# Altium schematic sheet MCU_144_2.SchDoc: MCU
size A3; DocumentNumber: MB1137; Revision: B-01; SheetNumber: 2; SheetTotal: 6; Project: NUCLEO-XXXXZX
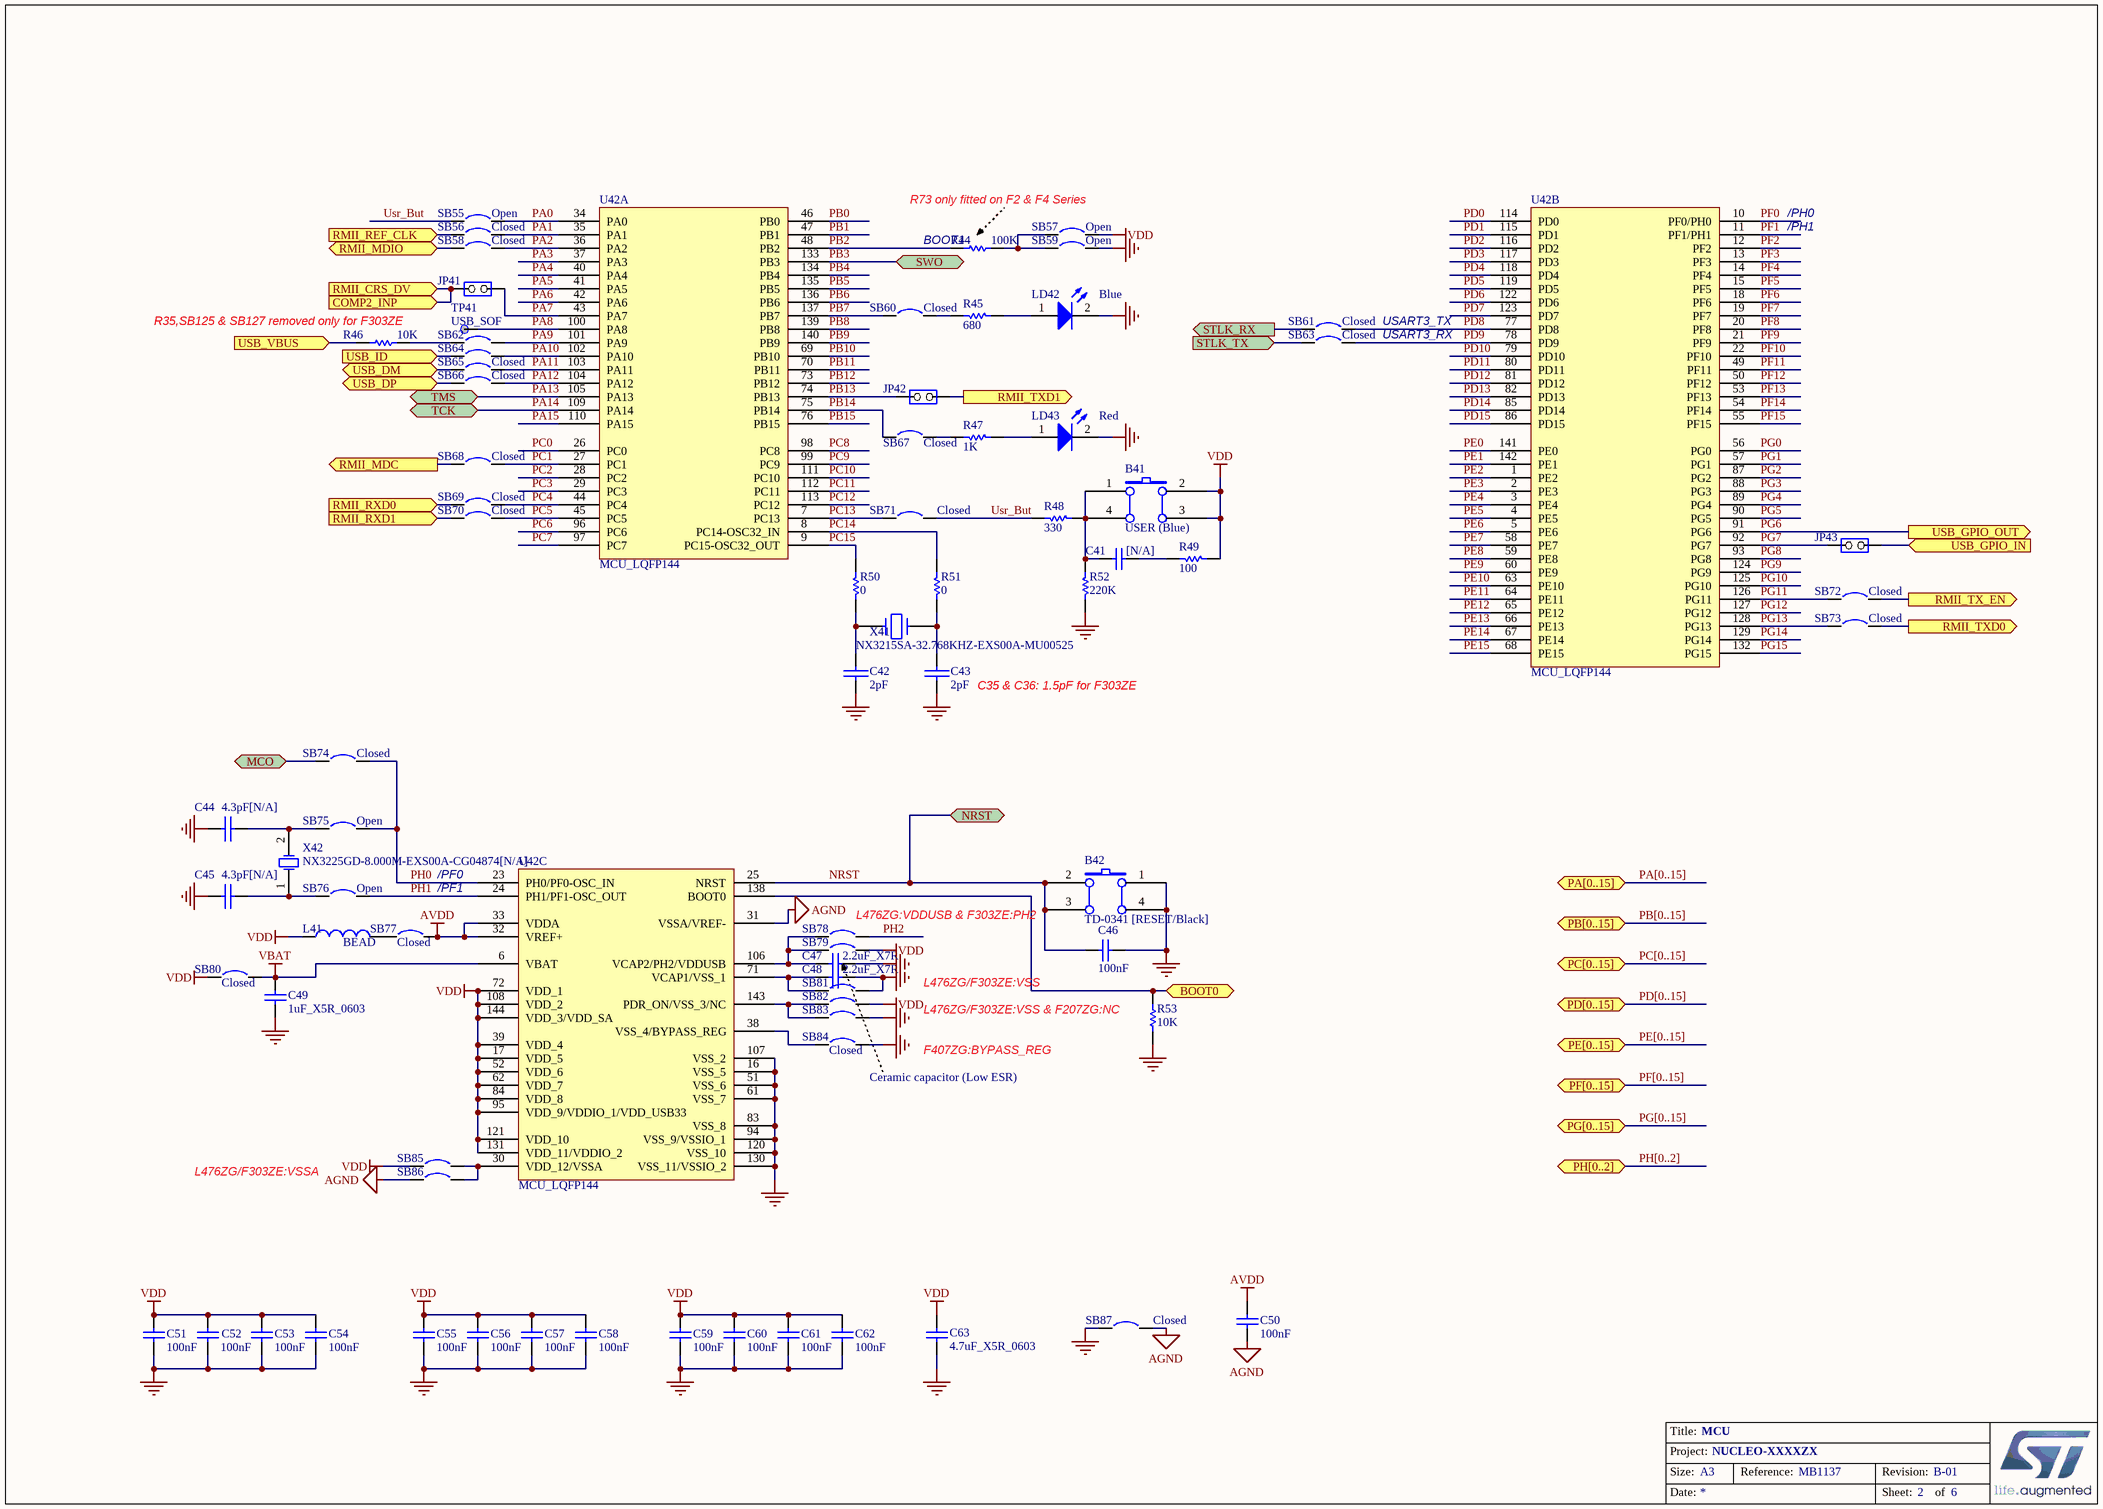
[diagram p0: MCU_144_2.SchDoc]

## Parts
B41  USER (Blue)  [PB-6X6mm-Blue]
B42  TD-0341 [RESET/Black]  [PB-6X6mm-Black]
C41  [N/A]  [0603C]
C42  2pF  [0603C]
C43  2pF  [0603C]
C44  4.3pF[N/A]  [0603C]
C45  4.3pF[N/A]  [0603C]
C46  100nF  [0603C]
C47  2.2uF_X7R  [TAN-A]
C48  2.2uF_X7R  [TAN-A]
C49  1uF_X5R_0603  [0603C]
C50  100nF  [0603C]
C51  100nF  [0603C]
C52  100nF  [0603C]
C53  100nF  [0603C]
C54  100nF  [0603C]
C55  100nF  [0603C]
C56  100nF  [0603C]
C57  100nF  [0603C]
C58  100nF  [0603C]
C59  100nF  [0603C]
C60  100nF  [0603C]
C61  100nF  [0603C]
C62  100nF  [0603C]
C63  4.7uF_X5R_0603  [0603C]
JP41  (no value)  [HDR_1x2_2R54_V_M_S]
JP42  (no value)  [HDR_1x2_2R54_V_M_S]
JP43  (no value)  [HDR_1x2_2R54_V_M_S]
L41  BEAD  [0603L]
LD42  Blue  [0603D-B]
LD43  Red  [0603D-R]
R44  100K  [0603R]
R45  680  [0603R]
R46  10K  [0603R]
R47  1K  [0603R]
R48  330  [0603R]
R49  100  [0603R]
R50  0  [0603R]
R51  0  [0603R]
R52  220K  [0603R]
R53  10K  [0603R]
SB55  Open  [SB_0603]
SB56  Closed  [SB_0603]
SB57  Open  [SB_0603]
SB58  Closed  [SB_0603]
SB59  Open  [SB_0603]
SB60  Closed  [SB_0603]
SB61  Closed  [SB_0603]
SB62  Circuit Breaker  [SB_0603]  (value not drawn)
SB63  Closed  [SB_0603]
SB64  Circuit Breaker  [SB_0603]  (value not drawn)
SB65  Closed  [SB_0603]
SB66  Closed  [SB_0603]
SB67  Closed  [SB_0603]
SB68  Closed  [SB_0603]
SB69  Closed  [SB_0603]
SB70  Closed  [SB_0603]
SB71  Closed  [SB_0603]
SB72  Closed  [SB_0603]
SB73  Closed  [SB_0603]
SB74  Closed  [SB_0603]
SB75  Open  [SB_0603]
SB76  Open  [SB_0603]
SB77  Closed  [SB_0603]
SB78  Circuit Breaker  [SB_0603]  (value not drawn)
SB79  Circuit Breaker  [SB_0603]  (value not drawn)
SB80  Closed  [SB_0603]
SB81  Circuit Breaker  [SB_0603]  (value not drawn)
SB82  Circuit Breaker  [SB_0603]  (value not drawn)
SB83  Circuit Breaker  [SB_0603]  (value not drawn)
SB84  Closed  [SB_0603]
SB85  Circuit Breaker  [SB_0603]  (value not drawn)
SB86  Circuit Breaker  [SB_0603]  (value not drawn)
SB87  Closed  [SB_0603]
TP41  USB_SOF  [TP]
U42  MCU_LQFP144  [LQFP144_0R5_SKT]  (parts A,B,C of 3)
X41  NX3215SA-32.768KHZ-EXS00A-MU00525  [XTAL_2SM_3R2X1R5]
X42  NX3225GD-8.000M-EXS00A-CG04874[N/A]  [OSC_2SM_3R2x2R5]

## Ports
BOOT0, COMP2_INP (in), MCO, NRST, PA[0..15] (bidir), PB[0..15] (bidir), PC[0..15] (bidir), PD[0..15] (bidir), PE[0..15] (bidir), PF[0..15] (bidir), PG[0..15] (bidir), PH[0..2] (bidir), RMII_CRS_DV (in), RMII_MDC (out), RMII_MDIO (bidir), RMII_REF_CLK (in), RMII_RXD0 (in), RMII_RXD1 (in), RMII_TX_EN (out), RMII_TXD0 (out), RMII_TXD1 (out), STLK_RX (out), STLK_TX (in), SWO, TCK, TMS, USB_DM (bidir), USB_DP (bidir), USB_GPIO_IN (in), USB_GPIO_OUT (out), USB_ID (in), USB_VBUS (in)

## Nets
AGND: C50.2 SB86.1 SB87.2 U42.31(VSSA/VREF-)
AVDD: C50.1 SB77.2 U42.32(VREF+) U42.33(VDDA)
GND: B42.1(A0) B42.4(A1) C42.2 C43.2 C44.2 C45.2 C46.1 C47.2 C48.2 C49.2 C51.2 C52.2 C53.2 C54.2 C55.2 C56.2 C57.2 C58.2 C59.2 C60.2 C61.2 C62.2 C63.2 LD42.2(K) LD43.2(K) R52.2 R53.2 SB59.2 SB81.2 SB83.2 SB84.2 SB87.1 U42.16(VSS_5) U42.51(VSS_6) U42.61(VSS_7) U42.83(VSS_8) U42.94(VSS_9/VSSIO_1) U42.107(VSS_2) U42.120(VSS_10) U42.130(VSS_11/VSSIO_2)
VBAT: C49.1 SB80.2 U42.6(VBAT)
VDD: B41.2(B0) B41.3(B1) C51.1 C52.1 C53.1 C54.1 C55.1 C56.1 C57.1 C58.1 C59.1 C60.1 C61.1 C62.1 C63.1 L41.1 R49.1 SB57.2 SB79.2 SB80.1 SB82.2 SB85.1 U42.17(VDD_5) U42.39(VDD_4) U42.52(VDD_6) U42.62(VDD_7) U42.72(VDD_1) U42.84(VDD_8) U42.95(VDD_9/VDDIO_1/VDD_USB33) U42.108(VDD_2) U42.121(VDD_10) U42.131(VDD_11/VDDIO_2) U42.144(VDD_3/VDD_SA)
BOOT0: R53.1 U42.138(BOOT0) ; port BOOT0
COMP2_INP: JP41.2(NO) ; port RMII_CRS_DV, port COMP2_INP
MCO: SB74.1 ; port MCO
NRST: B42.2(B0) B42.3(B1) C46.2 U42.25(NRST) ; port NRST
PA0: SB55.2 U42.34(PA0)
PA1: SB56.2 U42.35(PA1)
PA2: SB58.2 U42.36(PA2)
PA3: U42.37(PA3)
PA4: U42.40(PA4)
PA5: U42.41(PA5)
PA6: U42.42(PA6)
PA7: JP41.1(COMMON) U42.43(PA7)
PA8: TP41.1 U42.100(PA8)
PA9: SB62.2 U42.101(PA9)
PA10: SB64.2 U42.102(PA10)
PA11: SB65.2 U42.103(PA11)
PA12: SB66.2 U42.104(PA12)
PA13: U42.105(PA13) ; port TMS
PA14: U42.109(PA14) ; port TCK
PA15: U42.110(PA15)
PB0: U42.46(PB0)
PB1: U42.47(PB1)
PB2: R44.1 U42.48(PB2)
PB3: U42.133(PB3) ; port SWO
PB4: U42.134(PB4)
PB5: U42.135(PB5)
PB6: U42.136(PB6)
PB7: SB60.1 U42.137(PB7)
PB8: U42.139(PB8)
PB9: U42.140(PB9)
PB10: U42.69(PB10)
PB11: U42.70(PB11)
PB12: U42.73(PB12)
PB13: JP42.2(NO) U42.74(PB13)
PB14: SB67.1 U42.75(PB14)
PB15: U42.76(PB15)
PC0: U42.26(PC0)
PC1: SB68.2 U42.27(PC1)
PC2: U42.28(PC2)
PC3: U42.29(PC3)
PC4: SB69.2 U42.44(PC4)
PC5: SB70.2 U42.45(PC5)
PC6: U42.96(PC6)
PC7: U42.97(PC7)
PC8: U42.98(PC8)
PC9: U42.99(PC9)
PC10: U42.111(PC10)
PC11: U42.112(PC11)
PC12: U42.113(PC12)
PC13: SB71.1 U42.7(PC13)
PC14: R51.2 U42.8(PC14-OSC32_IN)
PC15: R50.2 U42.9(PC15-OSC32_OUT)
PD0: U42.114(PD0)
PD1: U42.115(PD1)
PD2: U42.116(PD2)
PD3: U42.117(PD3)
PD4: U42.118(PD4)
PD5: U42.119(PD5)
PD6: U42.122(PD6)
PD7: U42.123(PD7)
PD8: SB61.2 U42.77(PD8)
PD9: SB63.2 U42.78(PD9)
PD10: U42.79(PD10)
PD11: U42.80(PD11)
PD12: U42.81(PD12)
PD13: U42.82(PD13)
PD14: U42.85(PD14)
PD15: U42.86(PD15)
PE0: U42.141(PE0)
PE1: U42.142(PE1)
PE2: U42.1(PE2)
PE3: U42.2(PE3)
PE4: U42.3(PE4)
PE5: U42.4(PE5)
PE6: U42.5(PE6)
PE7: U42.58(PE7)
PE8: U42.59(PE8)
PE9: U42.60(PE9)
PE10: U42.63(PE10)
PE11: U42.64(PE11)
PE12: U42.65(PE12)
PE13: U42.66(PE13)
PE14: U42.67(PE14)
PE15: U42.68(PE15)
PF0: U42.10(PF0/PH0)
PF1: U42.11(PF1/PH1)
PF2: U42.12(PF2)
PF3: U42.13(PF3)
PF4: U42.14(PF4)
PF5: U42.15(PF5)
PF6: U42.18(PF6)
PF7: U42.19(PF7)
PF8: U42.20(PF8)
PF9: U42.21(PF9)
PF10: U42.22(PF10)
PF11: U42.49(PF11)
PF12: U42.50(PF12)
PF13: U42.53(PF13)
PF14: U42.54(PF14)
PF15: U42.55(PF15)
PG0: U42.56(PG0)
PG1: U42.57(PG1)
PG2: U42.87(PG2)
PG3: U42.88(PG3)
PG4: U42.89(PG4)
PG5: U42.90(PG5)
PG6: U42.91(PG6) ; port USB_GPIO_OUT
PG7: JP43.2(NO) U42.92(PG7)
PG8: U42.93(PG8)
PG9: U42.124(PG9)
PG10: U42.125(PG10)
PG11: SB72.1 U42.126(PG11)
PG12: U42.127(PG12)
PG13: SB73.1 U42.128(PG13)
PG14: U42.129(PG14)
PG15: U42.132(PG15)
PH0: SB74.2 SB75.2 U42.23(PH0/PF0-OSC_IN)
PH1: SB76.2 U42.24(PH1/PF1-OSC_OUT)
PH2: SB78.2
RMII_MDC: SB68.1 ; port RMII_MDC
RMII_MDIO: SB58.1 ; port RMII_MDIO
RMII_REF_CLK: SB56.1 ; port RMII_REF_CLK
RMII_RXD0: SB69.1 ; port RMII_RXD0
RMII_RXD1: SB70.1 ; port RMII_RXD1
RMII_TX_EN: SB72.2 ; port RMII_TX_EN
RMII_TXD0: SB73.2 ; port RMII_TXD0
RMII_TXD1: JP42.1(COMMON) ; port RMII_TXD1
STLK_RX: SB61.1 ; port STLK_RX
STLK_TX: SB63.1 ; port STLK_TX
USB_DM: SB65.1 ; port USB_DM
USB_DP: SB66.1 ; port USB_DP
USB_GPIO_IN: JP43.1(COMMON) ; port USB_GPIO_IN
USB_ID: SB64.1 ; port USB_ID
USB_VBUS: R46.1 ; port USB_VBUS
Usr_But: R48.2 SB55.1 SB71.2
NetB41_1: B41.1(A0) B41.4(A1) C41.2 R48.1 R52.1
NetC41_1: C41.1 R49.2
NetC42_1: C42.1 R50.1 X41.1
NetC43_1: C43.1 R51.1 X41.2
NetC44_1: C44.1 SB75.1 X42.2(OSC2)
NetC45_1: C45.1 SB76.1 X42.1(OSC1)
NetC47_1: C47.1 SB78.1 SB79.1 U42.106(VCAP2/PH2/VDDUSB)
NetC48_1: C48.1 SB81.1 U42.71(VCAP1/VSS_1)
NetL41_2: L41.2 SB77.1
NetLD42_1: LD42.1(A) R45.2
NetLD43_1: LD43.1(A) R47.2
NetR44_2: R44.2 SB57.1 SB59.1
NetR45_1: R45.1 SB60.2
NetR46_2: R46.2 SB62.1
NetR47_1: R47.1 SB67.2
NetSB82_1: SB82.1 SB83.1 U42.143(PDR_ON/VSS_3/NC)
NetSB84_1: SB84.1 U42.38(VSS_4/BYPASS_REG)
NetSB85_2: SB85.2 SB86.2 U42.30(VDD_12/VSSA)

## Buses and harness runs
bus PA[0..15] = port PA[0..15]
bus PB[0..15] = port PB[0..15]
bus PC[0..15] = port PC[0..15]
bus PD[0..15] = port PD[0..15]
bus PE[0..15] = port PE[0..15]
bus PF[0..15] = port PF[0..15]
bus PG[0..15] = port PG[0..15]
bus PH[0..2] = port PH[0..2]

## Notes on the sheet
- R73 only fitted on F2 & F4 Series
- (near R44) BOOT1
- /PH0
- /PH1
- (near R46) R35,SB125 & SB127 removed only for F303ZE
- USART3_TX
- USART3_RX
- (near C43) C35 & C36: 1.5pF for F303ZE
- /PF0
- /PF1
- (near SB78) L476ZG:VDDUSB & F303ZE:PH2
- L476ZG/F303ZE:VSS
- L476ZG/F303ZE:VSS & F207ZG:NC
- F407ZG:BYPASS_REG
- (near SB84) Ceramic capacitor (Low ESR)
- L476ZG/F303ZE:VSSA
- Title:
- Project:
- Size:
- Date:
- A3
- Reference:
- Sheet:
- Revision:
- of

## Library data of the parts
B41 B42 = SW PUSHBUTTON: SE PUSHBUTTON
C41 C46 = CAP: Capacitor; Value: 100pF; Published: 8-Jun-2000; Revision: July-2002: Re-released for DXP Platform.; Publisher: Altium Limited
C42-C45 = CAP: Capacitor
C47 C48 = Cap_2.2uF_X7R_10%_0805: Capacitor,2.2uF,16V, X7R,10%,0805,YAGEO; Manuf_Part_1: CC0805KKX7R7BB225; Revision: July-2002: Re-released for DXP Platform.; Value: 2.2uF; Order: CC0805KKX7R7BB225; Manuf_1: YAGEO
C49 = CAP SMD 0603  X5R 1µF 25V 10%: 0603  X5R 1µF; Rated voltage: 25V; Tolerance: 10%; Manufacturer: *; Manufacturer P/N: *; Order code Farnell: 1288202RL; Value: 1µF; Power: *; Technology: X5R; Temperature  Factor: *; Temperature Max: +125°C; Temperature Min: -55°C; STS Code: *
C50-C62 = Cap: Capacitor; Value: 10nF; Published: 8-Jun-2000; Revision: July-2002: Re-released for DXP Platform.; Publisher: Altium Limited
C63 = CAP SMD 0603  X5R 1µF 25V 10%: 0603  X5R 4.7uF; Value: 1µF; Rated voltage: 25V; Tolerance: 10%; Manufacturer: *; Manufacturer P/N: *; Order code Farnell: 1288202RL; Power: *; Technology: X5R; Temperature  Factor: *; Temperature Max: +125°C; Temperature Min: -55°C; STS Code: *
JP41-JP43 = JP2
L41 = Inductor: Value: 100uH; Published: 8-Jun-2000; Revision: July-2002: Re-released for DXP Platform.; Publisher: Altium Limited
LD42 LD43 = LED2: Typical RED, GREEN, YELLOW, AMBER GaAs LED; Published: 8-Jun-2000; Revision: July-2002: Re-released for DXP Platform.; Publisher: Altium Limited
R44 R52 R53 = res1: Resistor; Value: 1K; Published: 8-Jun-2000; Revision: July-2002: Re-released for DXP Platform.; Publisher: Altium Limited
R45 R48-R51 = Res1: Resistor; Value: 1K; Published: 8-Jun-2000; Revision: July-2002: Re-released for DXP Platform.; Publisher: Altium Limited
R46 = Resistor_ST: Resistor 0402 / 0603 / 0805; Value: 10K
R47 = Res1: Resistor; Published: 8-Jun-2000; Revision: July-2002: Re-released for DXP Platform.; Publisher: Altium Limited; Value: 1K
SB55 SB57 SB59 SB75 SB76 = Circuit Breaker: Published: 24-Mar-1999; Revision: July-2002: Re-released for DXP Platform.; Publisher: Altium Limited
SB56 SB58 SB60 SB61 SB63 SB65-SB74 SB77 SB80 SB84 SB87 = Circuit Breaker_close: Circuit Breaker; Published: 24-Mar-1999; Revision: July-2002: Re-released for DXP Platform.; Publisher: Altium Limited
SB62 SB64 SB78 SB79 SB81-SB83 SB85 SB86 = Circuit Breaker: Solder: NO; Published: 24-Mar-1999; Revision: July-2002: Re-released for DXP Platform.; Publisher: Altium Limited
TP41 = TP
X41 = CRYSTAL_32K: Crystal
X42 = XTAL: Crystal Oscillator; Published: 8-Jun-2000; LatestRevisionDate: 17-Jul-2002; LatestRevisionNote: Re-released for DXP Platform.; PackageReference: R38; Publisher: Altium Limited